# Altium schematic sheet Power.SchDoc
size A
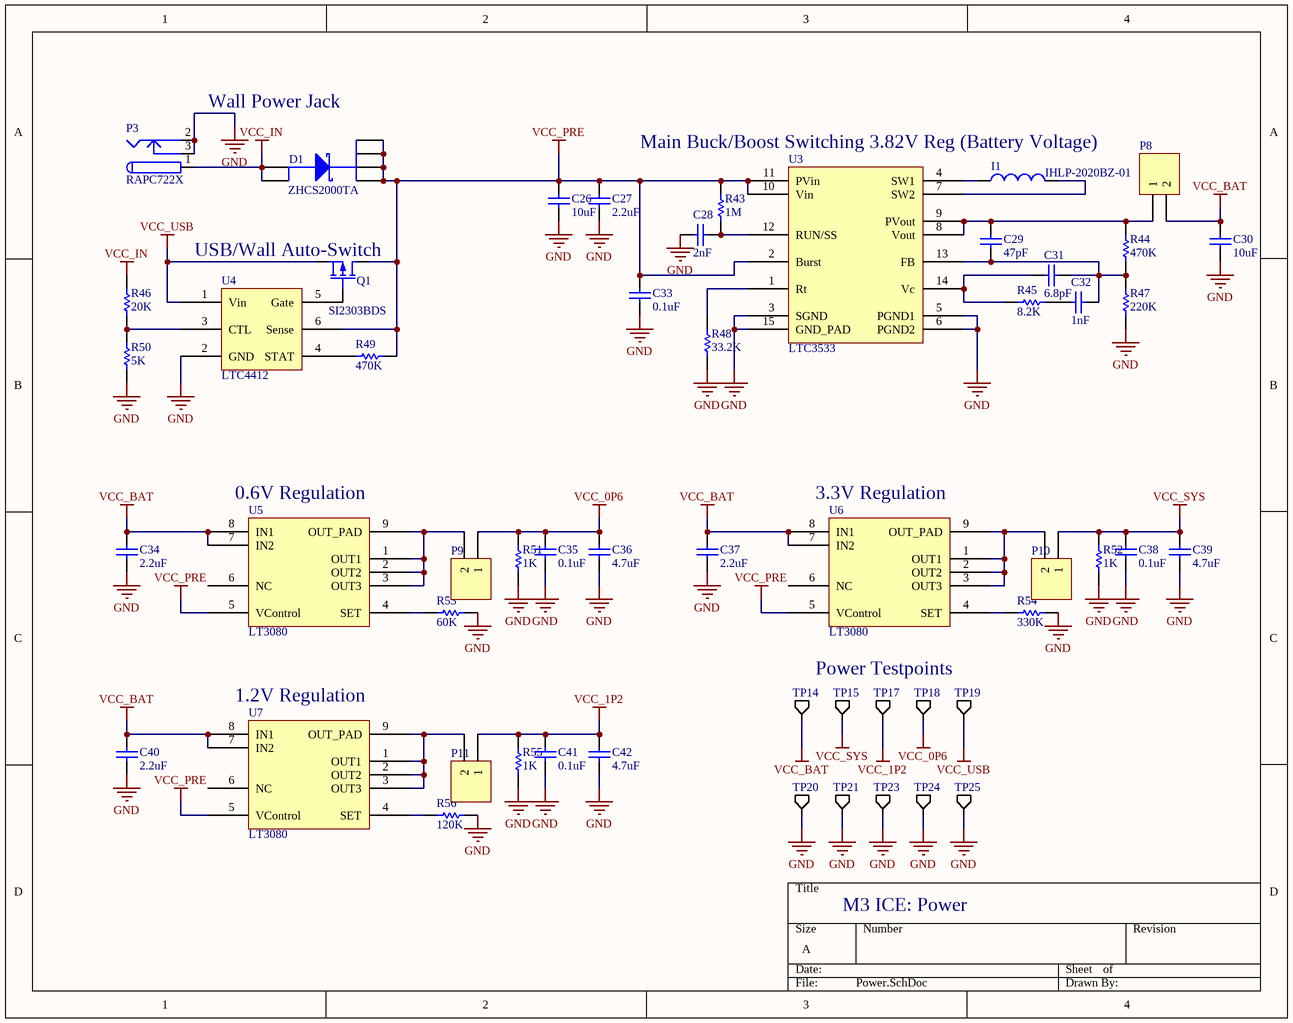
[diagram p0: Power.SchDoc]

## Parts
C26  value 10uF  [0805]  (hidden comment: Cap Chip)
C27  value 2.2uF  [1608[0603]]  (hidden comment: Cap Semi)
C28  value 2nF  [1608[0603]]  (hidden comment: Cap Semi)
C29  value 47pF  [1608[0603]]  (hidden comment: Cap Semi)
C30  value 10uF  [0805]  (hidden comment: Cap Chip)
C31  value 6.8pF  [1608[0603]]  (hidden comment: Cap Semi)
C32  value 1nF  [1608[0603]]  (hidden comment: Cap Semi)
C33  value 0.1uF  [1608[0603]]  (hidden comment: Cap Semi)
C34  value 2.2uF  [1608[0603]]  (hidden comment: Cap Semi)
C35  value 0.1uF  [1608[0603]]  (hidden comment: Cap Semi)
C36  value 4.7uF  [0805]  (hidden comment: Cap Chip)
C37  value 2.2uF  [1608[0603]]  (hidden comment: Cap Semi)
C38  value 0.1uF  [1608[0603]]  (hidden comment: Cap Semi)
C39  value 4.7uF  [0805]  (hidden comment: Cap Chip)
C40  value 2.2uF  [1608[0603]]  (hidden comment: Cap Semi)
C41  value 0.1uF  [1608[0603]]  (hidden comment: Cap Semi)
C42  value 4.7uF  [0805]  (hidden comment: Cap Chip)
D1  ZHCS2000TA  [SOT23-6_L]
I1  IHLP-2020BZ-01  [INDUCTOR_5.49mm_5.18mm]
P3  RAPC722X  [RAPC722X]
P8  Header 2  [HDR1X2]  (value not drawn)
P9  Header 2  [HDR1X2]  (value not drawn)
P10  Header 2  [HDR1X2]  (value not drawn)
P11  Header 2  [HDR1X2]  (value not drawn)
Q1  SI2303BDS  [SOT-23_N]
R43  value 1M  [0603]  (hidden comment: Res Chip)
R44  value 470K  [0603]  (hidden comment: Res Chip)
R45  value 8.2K  [0603]  (hidden comment: Res Chip)
R46  value 20K  [0603]  (hidden comment: Res Chip)
R47  value 220K  [0603]  (hidden comment: Res Chip)
R48  value 33.2K  [0603]  (hidden comment: Res Chip)
R49  value 470K  [0603]  (hidden comment: Res Chip)
R50  value 5K  [0603]  (hidden comment: Res Chip)
R51  value 1K  [0603]  (hidden comment: Res Chip)
R52  value 1K  [0603]  (hidden comment: Res Chip)
R53  value 60K  [0603]  (hidden comment: Res Chip)
R54  value 330K  [0603]  (hidden comment: Res Chip)
R55  value 1K  [0603]  (hidden comment: Res Chip)
R56  value 120K  [0603]  (hidden comment: Res Chip)
TP14  TP  [TP]  (value not drawn)
TP15  TP  [TP]  (value not drawn)
TP17  TP  [TP]  (value not drawn)
TP18  TP  [TP]  (value not drawn)
TP19  TP  [TP]  (value not drawn)
TP20  TP  [TP]  (value not drawn)
TP21  TP  [TP]  (value not drawn)
TP23  TP  [TP]  (value not drawn)
TP24  TP  [TP]  (value not drawn)
TP25  TP  [TP]  (value not drawn)
U3  LTC3533  [14-WFDFN]
U4  LTC4412  [SOT23-6_L]
U5  LT3080  [MSOP-8]
U6  LT3080  [MSOP-8]
U7  LT3080  [MSOP-8]

## Nets
GND: C26.1 C27.1 C28.2 C30.1 C33.1 C34.1 C35.1 C36.1 C37.1 C38.1 C39.1 C40.1 C41.1 C42.1 P3.2 P3.3 R47.2 R48.1 R50.1 R51.1 R52.1 R53.1 R54.1 R55.1 R56.1 TP20.1(A) TP21.1(A) TP23.1(A) TP24.1(A) TP25.1(A) U3.3(SGND) U3.5(PGND1) U3.6(PGND2) U3.15(GND_PAD) U4.2(GND)
VCC_0P6: C35.2 C36.2 P9.1 R51.2 TP18.1(A)
VCC_1P2: C41.2 C42.2 P11.1 R55.2 TP17.1(A)
VCC_BAT: C30.2 C34.2 C37.2 C40.2 P8.2 TP14.1(A) U5.7(IN2) U5.8(IN1) U6.7(IN2) U6.8(IN1) U7.7(IN2) U7.8(IN1)
VCC_IN: D1.3(A) D1.4(A) P3.1 R46.2
VCC_PRE: C26.2 C27.2 C33.2 D1.1(K) D1.2(K) D1.5(K) D1.6(K) Q1.3(D) R43.2 R49.1 U3.2(Burst) U3.10(Vin) U3.11(PVin) U4.6(Sense) U5.5(VControl) U6.5(VControl) U7.5(VControl)
VCC_SYS: C38.2 C39.2 P10.1 R52.2 TP15.1(A)
VCC_USB: Q1.2(S) TP19.1(A) U4.1(Vin)
NetC28_1: C28.1 R43.1 U3.12(RUN/SS)
NetC29_1: C29.1 C31.1 C32.1 R44.1 R47.1 U3.13(FB)
NetC29_2: C29.2 P8.1 R44.2 U3.8(Vout) U3.9(PVout)
NetC31_2: C31.2 R45.2 U3.14(Vc)
NetC32_2: C32.2 R45.1
NetI1_1: I1.1 U3.4(SW1)
NetI1_2: I1.2 U3.7(SW2)
NetP9_2: P9.2 U5.1(OUT1) U5.2(OUT2) U5.3(OUT3) U5.9(OUT_PAD)
NetP10_2: P10.2 U6.1(OUT1) U6.2(OUT2) U6.3(OUT3) U6.9(OUT_PAD)
NetP11_2: P11.2 U7.1(OUT1) U7.2(OUT2) U7.3(OUT3) U7.9(OUT_PAD)
NetQ1_1: Q1.1(G) U4.5(Gate)
NetR46_1: R46.1 R50.2 U4.3(CTL)
NetR48_2: R48.2 U3.1(Rt)
NetR49_2: R49.2 U4.4(STAT)
NetR53_2: R53.2 U5.4(SET)
NetR54_2: R54.2 U6.4(SET)
NetR56_2: R56.2 U7.4(SET)

Not connected (* = marked no-connect by the designer): U5 6(NC); U6 6(NC); U7 6(NC)

## Notes on the sheet
- Wall Power Jack
- Main Buck/Boost Switching 3.82V Reg (Battery Voltage)
- (near Q1) USB/Wall Auto-Switch
- (near U5) 0.6V Regulation
- (near U6) 3.3V Regulation
- (near U7) 1.2V Regulation
- Power Testpoints
- M3 ICE: Power

## Library data of the parts
C26 C30 C36 C39 C42 = Cap Chip: Capacitor (Semiconductor SIM Model); Published: 8-Jun-2000; LatestRevisionDate: 29-May-2009; LatestRevisionNote: IPC-7351 Footprint Added.; PackageReference: C1206; Publisher: Altium Limited; PackageDescription: Chip Capacitor
C27-C29 C31-C35 C37 C38 C40 C41 = Cap Semi: Capacitor (Semiconductor SIM Model); Published: 8-Jun-2000; LatestRevisionDate: 29-May-2009; LatestRevisionNote: IPC-7351 Footprint Added.; PackageReference: C1206; Publisher: Altium Limited; PackageDescription: Chip Capacitor
D1 = ZHCS2000TA: Schottky Diode; Published: 8-Jun-2000; LatestRevisionDate: 17-Jul-2002; LatestRevisionNote: Re-released for DXP Platform.; PackageReference: SMB; Publisher: Altium Limited; PackageDescription: DO-214-AA/SMB; 2 C-Bend Leads; Body 5.3 x 3.6 mm, inc. leads (LxW); Code_JEDEC: DO-214-AA
I1 = Inductor IHLP-2020BZ-01: IHLP2020BZER2R2M01
P3 = RAPC722X: CONN POWERJACK MINI R/A T/H
P8-P11 = Header 2: Header, 2-Pin; LatestRevisionDate: 17-Jul-2002; LatestRevisionNote: Re-released for DXP Platform.; Publisher: Altium Limited
Q1 = SI2303BDS: P-Channel MOSFET
R43-R56 = Res Chip: Semiconductor Resistor; Published: 8-Jun-2000; LatestRevisionDate: 17-Jul-2002; LatestRevisionNote: Re-released for DXP Platform.; PackageReference: AXIAL-0.5; Publisher: Altium Limited; PackageDescription: Axial Device, Thru-Hole; 2 Leads; 0.5 in Pin Spacing